# EAGLE schematic node (EAGLE 6.3)
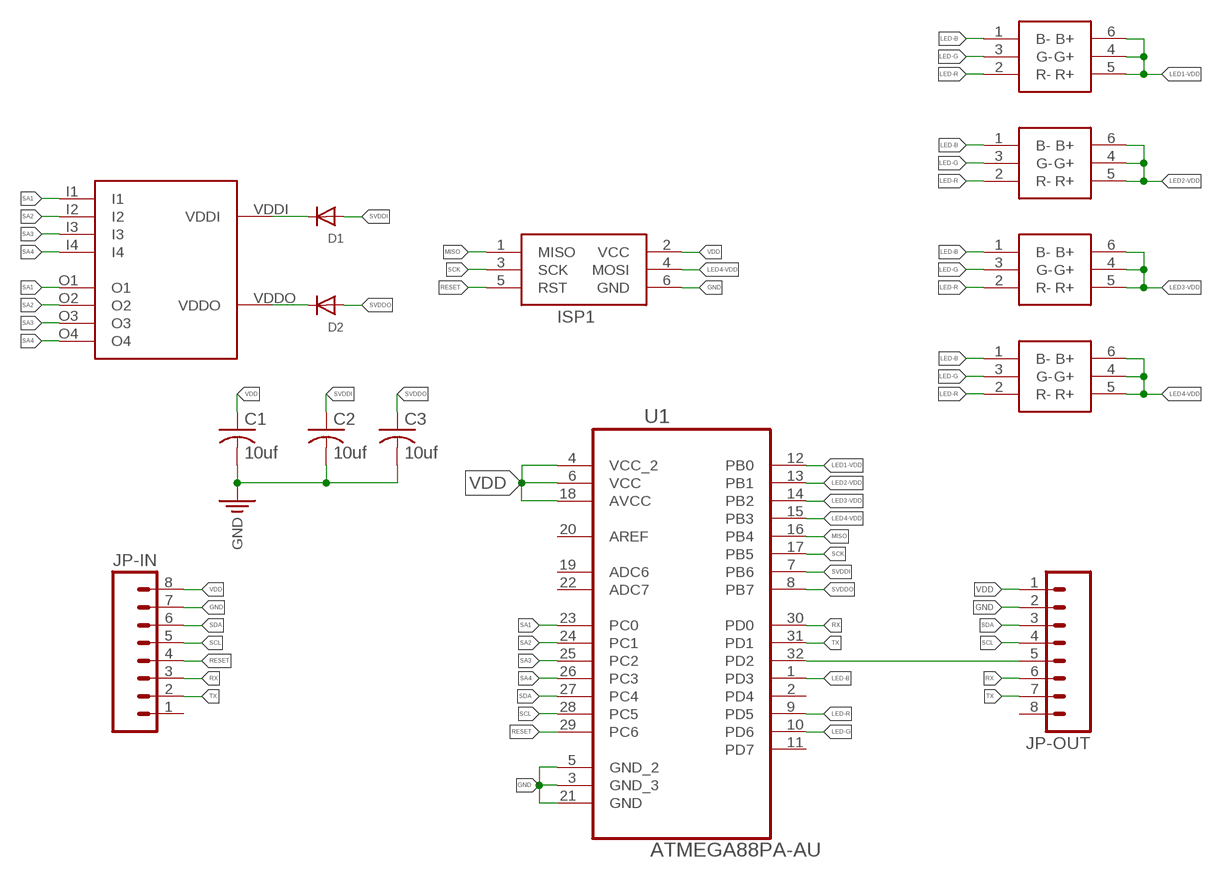
[diagram p0: schematic, sheet 1]

## Parts
C1  10uf  C-USC0805K  [C0805K]
C2  10uf  C-USC0805K  [C0805K]
C3  10uf  C-USC0805K  [C0805K]
D1  DIODESOD-323F  [SOD-323F]
D2  DIODESOD-323F  [SOD-323F]
ISP1  AVRISP-6  [AVRISP]
JP-IN  M08LONGPADS  [1X08_LONGPADS]
JP-OUT  M08LONGPADS  [1X08_LONGPADS]
LED1  SMT-RGB-6PLCC  [SMT-RGB-6PLCC]
LED2  SMT-RGB-6PLCC  [SMT-RGB-6PLCC]
LED3  SMT-RGB-6PLCC  [SMT-RGB-6PLCC]
LED4  SMT-RGB-6PLCC  [SMT-RGB-6PLCC]
U1  ATMEGA88PA-AU  [QFP80P900X900X120-32N]
U$2  SPS8-0.0.1  [SPS8-0.0.1]

## Nets
GND: C1.2 C2.2 C3.2 ISP1.6(GND) JP-IN.7 JP-OUT.2 U1.3(GND_3) U1.5(GND_2) U1.21(GND)
LED1-VDD: LED1.4(G+) LED1.5(R+) LED1.6(B+) U1.12(PB0)
LED2-VDD: LED2.4(G+) LED2.5(R+) LED2.6(B+) U1.13(PB1)
LED3-VDD: LED3.4(G+) LED3.5(R+) LED3.6(B+) U1.14(PB2)
LED4-VDD: ISP1.4(MOSI) LED4.4(G+) LED4.5(R+) LED4.6(B+) U1.15(PB3)
LED-B: LED1.1(B-) LED2.1(B-) LED3.1(B-) LED4.1(B-) U1.1(PD3)
LED-G: LED1.3(G-) LED2.3(G-) LED3.3(G-) LED4.3(G-) U1.10(PD6)
LED-R: LED1.2(R-) LED2.2(R-) LED3.2(R-) LED4.2(R-) U1.9(PD5)
MISO: ISP1.1(MISO) U1.16(PB4)
N$3: D1.C U$2.VDDI
N$4: D2.C U$2.VDDO
N$7: JP-OUT.5 U1.32(PD2)
RESET: ISP1.5(RST) JP-IN.4 U1.29(PC6)
RX: JP-IN.3 JP-OUT.6 U1.30(PD0)
SA1: U1.23(PC0) U$2.I1 U$2.O1
SA2: U1.24(PC1) U$2.I2 U$2.O2
SA3: U1.25(PC2) U$2.I3 U$2.O3
SA4: U1.26(PC3) U$2.I4 U$2.O4
SCK: ISP1.3(SCK) U1.17(PB5)
SCL: JP-IN.5 JP-OUT.4 U1.28(PC5)
SDA: JP-IN.6 JP-OUT.3 U1.27(PC4)
SVDDI: C2.1 D1.A U1.7(PB6)
SVDDO: C3.1 D2.A U1.8(PB7)
TX: JP-IN.2 JP-OUT.7 U1.31(PD1)
VDD: C1.1 ISP1.2(VCC) JP-IN.8 JP-OUT.1 U1.4(VCC_2) U1.6(VCC) U1.18(AVCC)
Unconnected: JP-IN.1 JP-OUT.8 U1.2(PD4) U1.11(PD7) U1.19(ADC6) U1.20(AREF) U1.22(ADC7)

## Library data of the parts
C1-C3 = adafruit:C-US: CAPACITOR, American symbol
D1 D2 = adafruit:DIODE: Diode SMADIODE - SMA Surface Mount Package 20V 1A Schottky Diode Digikey: 641-1014-6-ND DO-1N4148 - Through Hole Small Current Diode SOD-123 20V 1 A (.5mV Vf) Schottky Diode - Digikey: MBRX120TPMSCT-ND SOD-323 10V 570mA (.38mV Vf, 3ns) Schottky Diode - Digikey: ZLLS410CT-ND SOD-523 30V 30mA Schottky Diode (RB751S-40TE61) - Digikey: RB751S-40TE61CT-ND SOT23-R/W - SOT23 Package (R = Solder Paste/Reflow Ovens, W = Hand-Soldering) BAT54Film 40V 300mA - Digikey: 497-7162-1-ND
ISP1 = adafruit:AVRISP: AVR ISP HEADER Standard 6 pin header for AVR programming
JP-IN JP-OUT = OndraSterver:M08: Header 8 Standard 8-pin 0.1" header. Use with straight break away headers (SKU : PRT-00116), right angle break away headers (PRT-00553), swiss pins (PRT-00743), machine pins (PRT-00117), and female headers (PRT-00115).
LED1-LED4 = tmpvar:SMT-RGB-6PLCC
U1 = Atmel_By_element14_Batch_1:ATMEGA88PA-AU: 8-bit Microcontroller with Bytes In-System Programmable Flash; MPN: ATMEGA88PA-AU; OC_FARNELL: 1715490; OC_NEWARK: 15R0271; PACKAGE: QFP-32; SUPPLIER: Atmel
U$2 = tmpvar:SPS8-0.0.1